# EAGLE schematic B4L_UI (EAGLE 9.2.2)

## Sheet 1 of 2
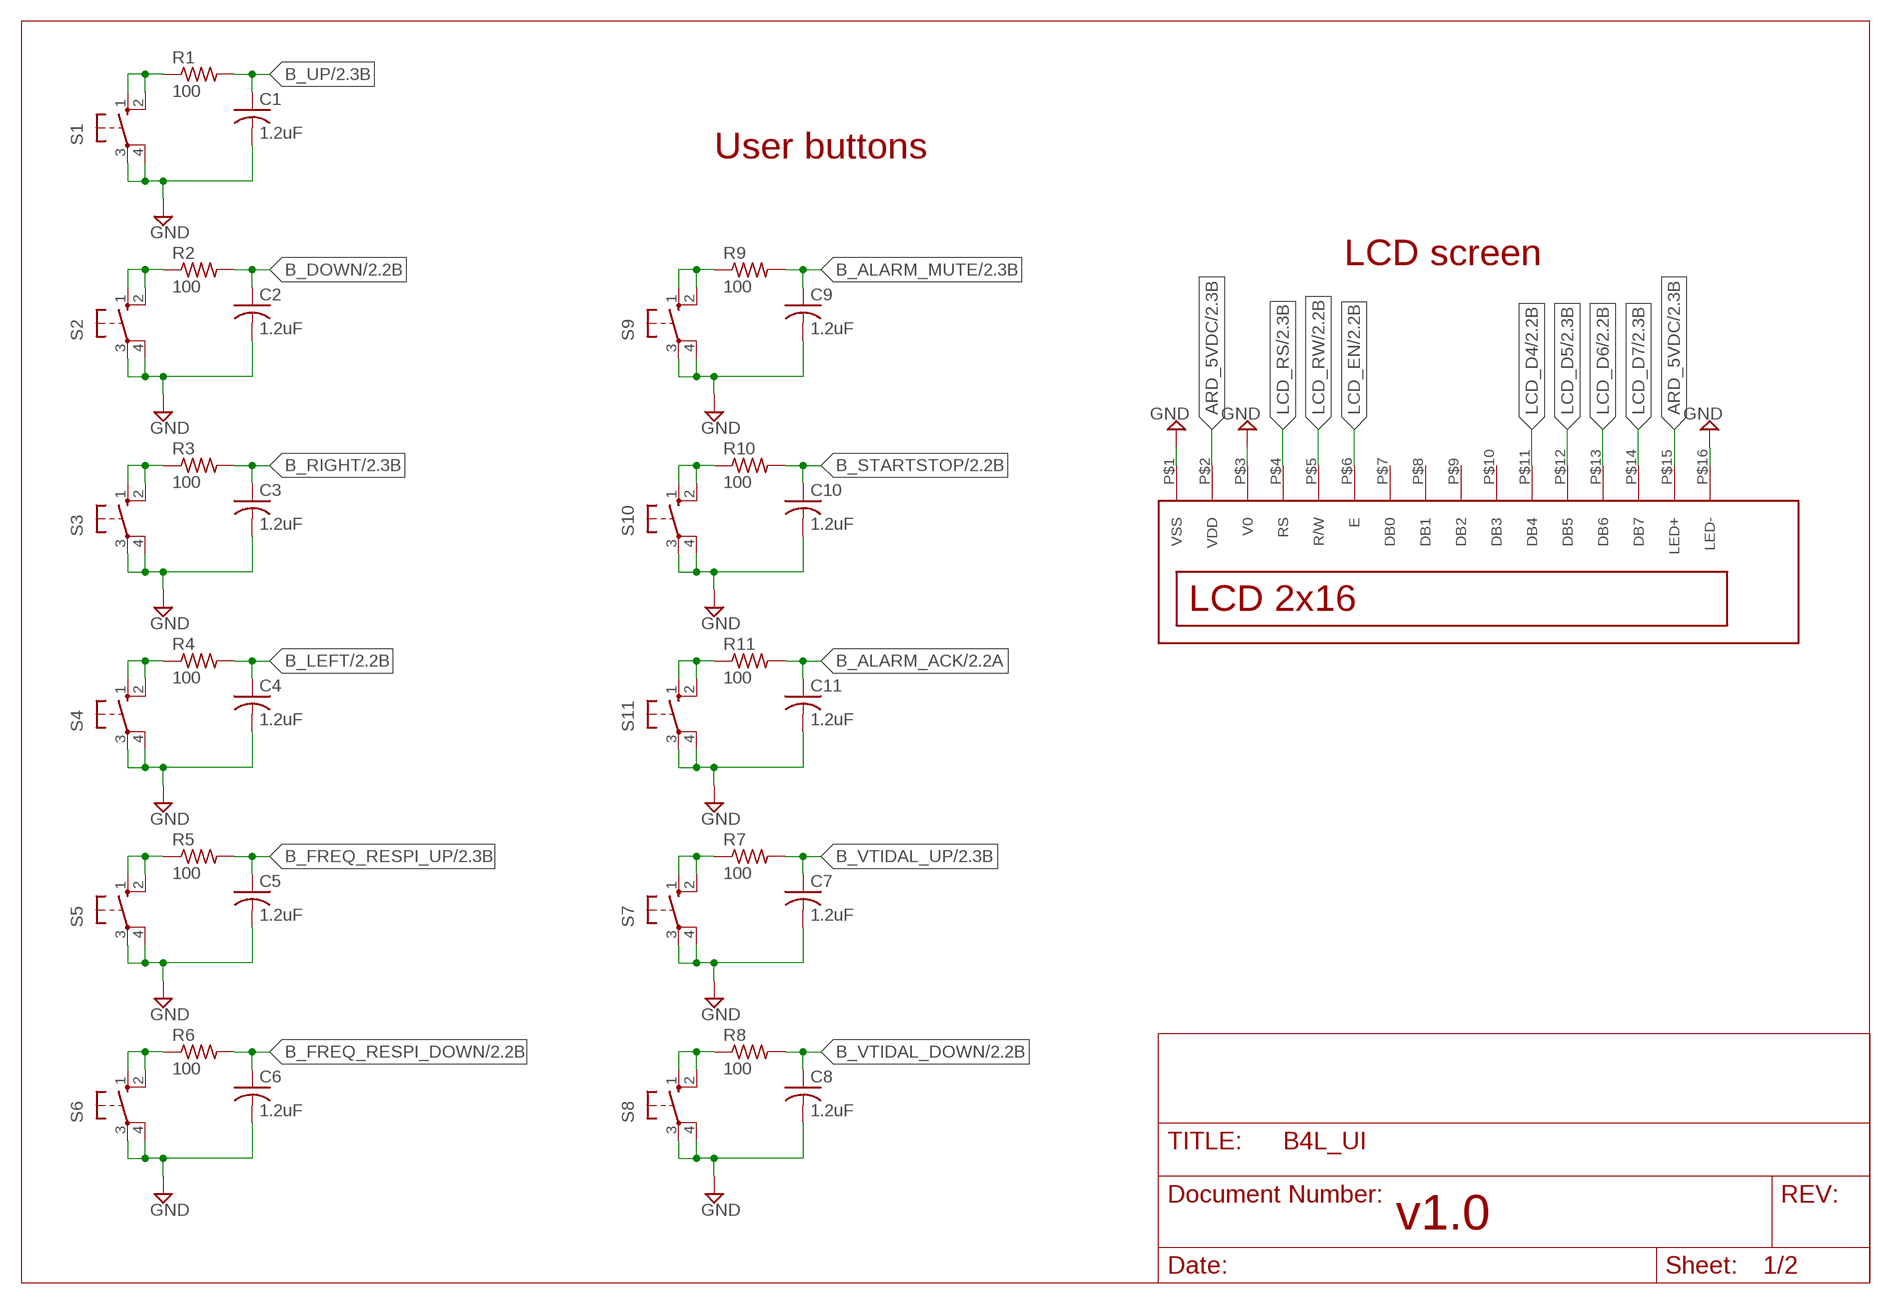
[diagram p0: schematic, sheet 1]

### Parts
C1  1.2uF  C-US050-050X075  [C050-050X075]
C2  1.2uF  C-US050-050X075  [C050-050X075]
C3  1.2uF  C-US050-050X075  [C050-050X075]
C4  1.2uF  C-US050-050X075  [C050-050X075]
C5  1.2uF  C-US050-050X075  [C050-050X075]
C6  1.2uF  C-US050-050X075  [C050-050X075]
C7  1.2uF  C-US050-050X075  [C050-050X075]
C8  1.2uF  C-US050-050X075  [C050-050X075]
C9  1.2uF  C-US050-050X075  [C050-050X075]
C10  1.2uF  C-US050-050X075  [C050-050X075]
C11  1.2uF  C-US050-050X075  [C050-050X075]
R1  100  R-US_0309/12  [0309/12]
R2  100  R-US_0309/12  [0309/12]
R3  100  R-US_0309/12  [0309/12]
R4  100  R-US_0309/12  [0309/12]
R5  100  R-US_0309/12  [0309/12]
R6  100  R-US_0309/12  [0309/12]
R7  100  R-US_0309/12  [0309/12]
R8  100  R-US_0309/12  [0309/12]
R9  100  R-US_0309/12  [0309/12]
R10  100  R-US_0309/12  [0309/12]
R11  100  R-US_0309/12  [0309/12]
S1  40-XX  [B3F-40XX]
S2  40-XX  [B3F-40XX]
S3  40-XX  [B3F-40XX]
S4  40-XX  [B3F-40XX]
S5  40-XX  [B3F-40XX]
S6  40-XX  [B3F-40XX]
S7  40-XX  [B3F-40XX]
S8  40-XX  [B3F-40XX]
S9  40-XX  [B3F-40XX]
S10  40-XX  [B3F-40XX]
S11  40-XX  [B3F-40XX]
U$1  LCD_MC21605C6W-BNMLW-V2  [LCD_MC21605C6W-BNMLW-V2]

### Nets
ARD_5VDC: U$1.P$2(VDD) U$1.P$15(LED+) ; also sheet 2
B_ALARM_ACK: C11.1 R11.2 ; also sheet 2
B_ALARM_MUTE: C9.1 R9.2 ; also sheet 2
B_DOWN: C2.1 R2.2 ; also sheet 2
B_FREQ_RESPI_DOWN: C6.1 R6.2 ; also sheet 2
B_FREQ_RESPI_UP: C5.1 R5.2 ; also sheet 2
B_LEFT: C4.1 R4.2 ; also sheet 2
B_RIGHT: C3.1 R3.2 ; also sheet 2
B_STARTSTOP: C10.1 R10.2 ; also sheet 2
B_UP: C1.1 R1.2 ; also sheet 2
B_VTIDAL_DOWN: C8.1 R8.2 ; also sheet 2
B_VTIDAL_UP: C7.1 R7.2 ; also sheet 2
GND: C1.2 C2.2 C3.2 C4.2 C5.2 C6.2 C7.2 C8.2 C9.2 C10.2 C11.2 S1.3(P) S1.4(P1) S2.3(P) S2.4(P1) S3.3(P) S3.4(P1) S4.3(P) S4.4(P1) S5.3(P) S5.4(P1) S6.3(P) S6.4(P1) S7.3(P) S7.4(P1) S8.3(P) S8.4(P1) S9.3(P) S9.4(P1) S10.3(P) S10.4(P1) S11.3(P) S11.4(P1) U$1.P$1(VSS) U$1.P$3(V0) U$1.P$16(LED-) ; also sheet 2
LCD_D4: U$1.P$11(DB4) ; also sheet 2
LCD_D5: U$1.P$12(DB5) ; also sheet 2
LCD_D6: U$1.P$13(DB6) ; also sheet 2
LCD_D7: U$1.P$14(DB7) ; also sheet 2
LCD_EN: U$1.P$6(E) ; also sheet 2
LCD_RS: U$1.P$4(RS) ; also sheet 2
LCD_RW: U$1.P$5(R/W) ; also sheet 2
N$1: R1.1 S1.1(S) S1.2(S1)
N$3: R2.1 S2.1(S) S2.2(S1)
N$5: R3.1 S3.1(S) S3.2(S1)
N$7: R4.1 S4.1(S) S4.2(S1)
N$9: R5.1 S5.1(S) S5.2(S1)
N$10: R11.1 S11.1(S) S11.2(S1)
N$11: R9.1 S9.1(S) S9.2(S1)
N$13: R10.1 S10.1(S) S10.2(S1)
N$15: R8.1 S8.1(S) S8.2(S1)
N$17: R7.1 S7.1(S) S7.2(S1)
N$19: R6.1 S6.1(S) S6.2(S1)
Unconnected: U$1.P$7(DB0) U$1.P$8(DB1) U$1.P$9(DB2) U$1.P$10(DB3)

### Notes on the sheet
- User buttons
- LCD screen
- v1.0

## Sheet 2 of 2
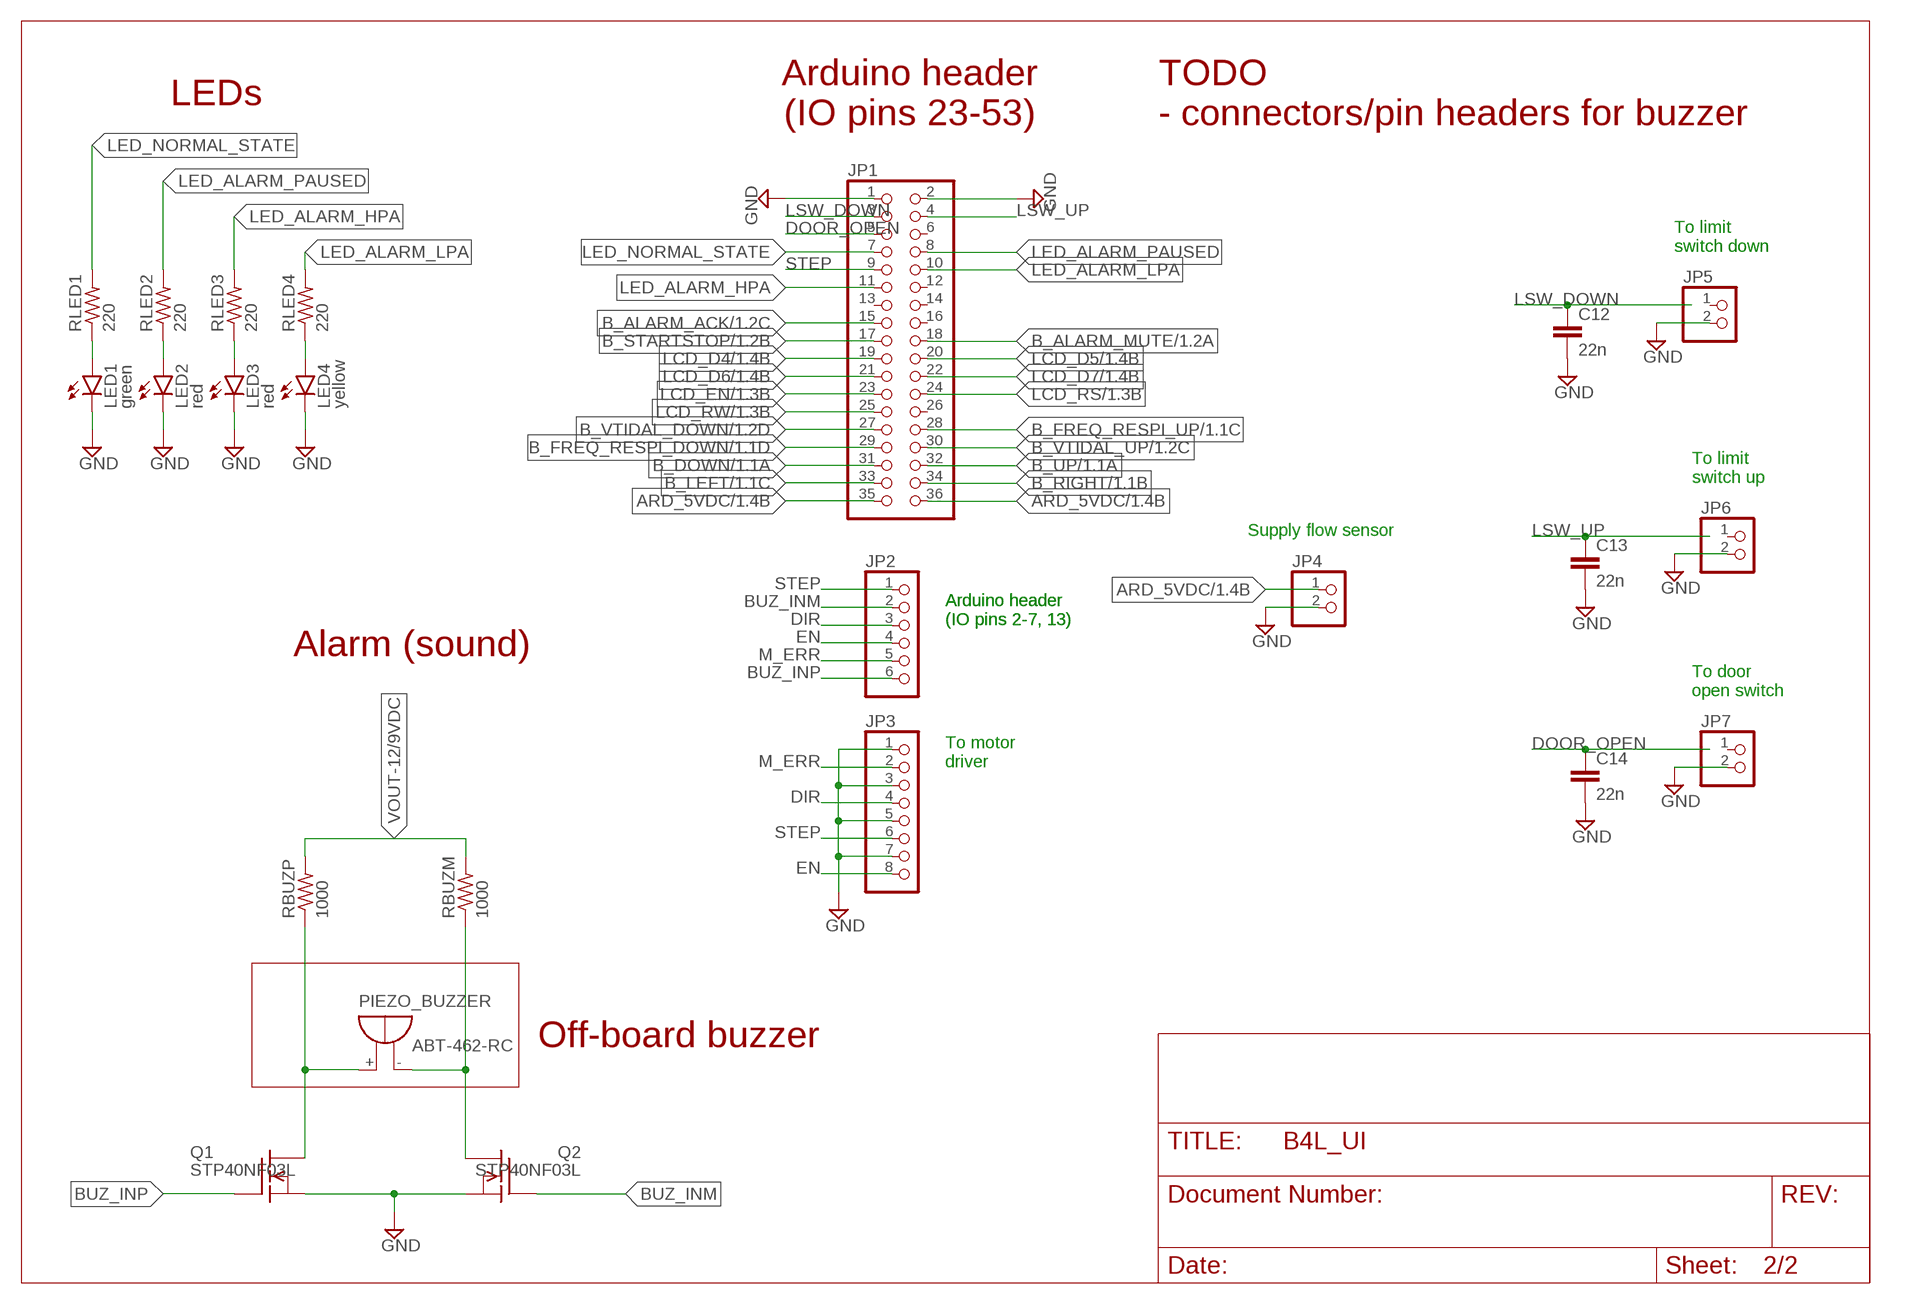
[diagram p1: schematic, sheet 2]

### Parts
C12  22n  C2,5-3  [C2.5-3]
C13  22n  C2,5-3  [C2.5-3]
C14  22n  C2,5-3  [C2.5-3]
JP1  PINHD-2X18  [2X18]
JP2  PINHD-1X6  [1X06]
JP3  PINHD-1X8  [1X08]
JP4  PINHD-1X2  [1X02]
JP5  PINHD-1X2  [1X02]
JP6  PINHD-1X2  [1X02]
JP7  PINHD-1X2  [1X02]
LED1  green  LED5MM  [LED5MM]
LED2  red  LED5MM  [LED5MM]
LED3  red  LED5MM  [LED5MM]
LED4  yellow  LED5MM  [LED5MM]
PIEZO_BUZZER  ABT-462-RC  F/TMB  [F/TMB]
Q1  STP40NF03L  BUZ10  [TO220]
Q2  STP40NF03L  BUZ10  [TO220]
RBUZM  1000  R-US_0309/12  [0309/12]
RBUZP  1000  R-US_0309/12  [0309/12]
RLED1  220  R-US_0309/12  [0309/12]
RLED2  220  R-US_0309/12  [0309/12]
RLED3  220  R-US_0309/12  [0309/12]
RLED4  220  R-US_0309/12  [0309/12]

### Nets
ARD5VDC: JP4.1
ARD_5VDC: JP1.35 JP1.36 ; also sheet 1
B_ALARM_ACK: JP1.15 ; also sheet 1
B_ALARM_MUTE: JP1.18 ; also sheet 1
B_DOWN: JP1.31 ; also sheet 1
B_FREQ_RESPI_DOWN: JP1.29 ; also sheet 1
B_FREQ_RESPI_UP: JP1.28 ; also sheet 1
B_LEFT: JP1.33 ; also sheet 1
B_RIGHT: JP1.34 ; also sheet 1
B_STARTSTOP: JP1.17 ; also sheet 1
B_UP: JP1.32 ; also sheet 1
B_VTIDAL_DOWN: JP1.27 ; also sheet 1
B_VTIDAL_UP: JP1.30 ; also sheet 1
BUZ_INM: JP2.2 Q2.1(G)
BUZ_INP: JP2.6 Q1.1(G)
DIR: JP2.3 JP3.4
DOOR_OPEN: C14.1 JP1.5
EN: JP2.4 JP3.8
GND: C12.2 C13.2 C14.2 JP1.1 JP1.2 JP3.1 JP3.3 JP3.5 JP3.7 JP4.2 JP5.2 JP6.2 JP7.2 LED1.K(C) LED2.K(C) LED3.K(C) LED4.K(C) Q1.3(S) Q2.3(S) ; also sheet 1
LCD_D4: JP1.19 ; also sheet 1
LCD_D5: JP1.20 ; also sheet 1
LCD_D6: JP1.21 ; also sheet 1
LCD_D7: JP1.22 ; also sheet 1
LCD_EN: JP1.23 ; also sheet 1
LCD_RS: JP1.24 ; also sheet 1
LCD_RW: JP1.25 ; also sheet 1
LED_ALARM_HPA: JP1.11 RLED3.2
LED_ALARM_LPA: JP1.10 RLED4.2
LED_ALARM_PAUSED: JP1.8 RLED2.2
LED_NORMAL_STATE: JP1.7 RLED1.2
LSW_DOWN: C12.1 JP1.3
LSW_UP: C13.1 JP1.4
M_ERR: JP2.5 JP3.2
N$2: LED3.A RLED3.1
N$4: LED4.A RLED4.1
N$6: LED1.A RLED1.1
N$8: LED2.A RLED2.1
N$12: PIEZO_BUZZER.+ Q1.2(D) RBUZP.1
N$14: PIEZO_BUZZER.- Q2.2(D) RBUZM.1
STEP: JP1.9 JP2.1 JP3.6
VOUT-12/9VDC: RBUZM.2 RBUZP.2
Unconnected: JP1.6 JP1.12 JP1.13 JP1.14 JP1.16 JP1.26 JP5.1 JP6.1 JP7.1

### Notes on the sheet
- LEDs
- Arduino header
  (IO pins 23-53)
- TODO
  - connectors/pin headers for buzzer
- To limit
  switch down
- To limit
  switch up
- Supply flow sensor
- Arduino header
  (IO pins 2-7, 13)
- Arduino header
  (IO pins 2-7, 13)
- Alarm (sound)
- To door
  open switch
- To motor
  driver
- Off-board buzzer

## Library data of the parts
C1-C11 = rcl:C-US: CAPACITOR, American symbol; SPICEPREFIX: C
C12-C14 = capacitor-wima:C: CAPACITOR naming: grid - package width
JP1 = pinhead:PINHD-2X18: PIN HEADER
JP2 = pinhead:PINHD-1X6: PIN HEADER
JP3 = pinhead:PINHD-1X8: PIN HEADER
JP4-JP7 = pinhead:PINHD-1X2: PIN HEADER
LED1-LED4 = led:LED: LED OSRAM: - CHIPLED LG R971, LG N971, LY N971, LG Q971, LY Q971, LO R971, LY R971 LH N974, LH R974 LS Q976, LO Q976, LY Q976 LO Q996 - Hyper CHIPLED LW Q18S LB Q993, LB Q99A, LB R99A - SideLED LS A670, LO A670, LY A670, LG A670, LP A670 LB A673, LV A673, LT A673, LW A673 LH A674 LY A675 LS A676, LA A676, LO A676, LY A676, LW A676 LS A679, LY A679, LG A679 - Hyper Micro SIDELED® LS Y876, LA Y876, LO Y876, LY Y876 LT Y87S - SmartLED LW L88C, LW L88S LB L89C, LB L89S, LG L890 LS L89K, LO L89K, LY L89K LS L896, LA L896, LO L896, LY L896 - TOPLED LS T670, LO T670, LY T670, LG T670, LP T670 LSG T670, LSP T670, LSY T670, LOP T670, LYG T670 LG T671, LOG T671, LSG T671 LB T673, LV T673, LT T673, LW T673 LH T674 LS T676, LA T676, LO T676, LY T676, LB T676, LH T676, LSB T676, LW T676 LB T67C, LV T67C, LT T67C, LS T67K, LO T67K, LY T67K, LW E67C LS E67B, LA E67B, LO E67B, LY E67B, LB E67C, LV E67C, LT E67C LW T67C LS T679, LY T679, LG T679 LS T770, LO T770, LY T770, LG T770, LP T770 LB T773, LV T773, LT T773, LW T773 LH T774 LS E675, LA E675, LY E675, LS T675 LS T776, LA T776, LO T776, LY T776, LB T776 LHGB T686 LT T68C, LB T68C - Hyper Mini TOPLED® LB M676 - Mini TOPLED Santana® LG M470 LS M47K, LO M47K, LY M47K Source: http://www.osram.convergy.de LUXEON: - LUMILED® LXK2-PW12-R00, LXK2-PW12-S00, LXK2-PW14-U00, LXK2-PW14-V00 LXK2-PM12-R00, LXK2-PM12-S00, LXK2-PM14-U00 LXK2-PE12-Q00, LXK2-PE12-R00, LXK2-PE12-S00, LXK2-PE14-T00, LXK2-PE14-U00 LXK2-PB12-K00, LXK2-PB12-L00, LXK2-PB12-M00, LXK2-PB14-N00, LXK2-PB14-P00, LXK2-PB14-Q00 LXK2-PR12-L00, LXK2-PR12-M00, LXK2-PR14-Q00, LXK2-PR14-R00 LXK2-PD12-Q00, LXK2-PD12-R00, LXK2-PD12-S00 LXK2-PH12-R00, LXK2-PH12-S00 LXK2-PL12-P00, LXK2-PL12-Q00, LXK2-PL12-R00 Source: www.luxeon.com KINGBRIGHT: KA-3528ASYC Source: www.kingbright.com
PIEZO_BUZZER = buzzer:F/TMB: BUZZER Source: Buerklin; OC_FARNELL: unknown; OC_NEWARK: unknown
Q1 Q2 = transistor-fet:BUZ10: N-Channel Enhancement MOSFET 50V; 20A; 0,080Ohm
R1-R11 RBUZM RBUZP RLED1-RLED4 = rcl:R-US_: RESISTOR, American symbol; SPICEPREFIX: R
S1-S11 = switch-omron:40-XX: OMRON SWITCH; MF: OMRON COMPONENTS USA; MPN: B3F-4000; OC_FARNELL: 176434; OC_NEWARK: 36K3105
U$1 = custom:LCD_MC21605C6W-BNMLW-V2